# Altium project Oxy_Project.PrjPcb
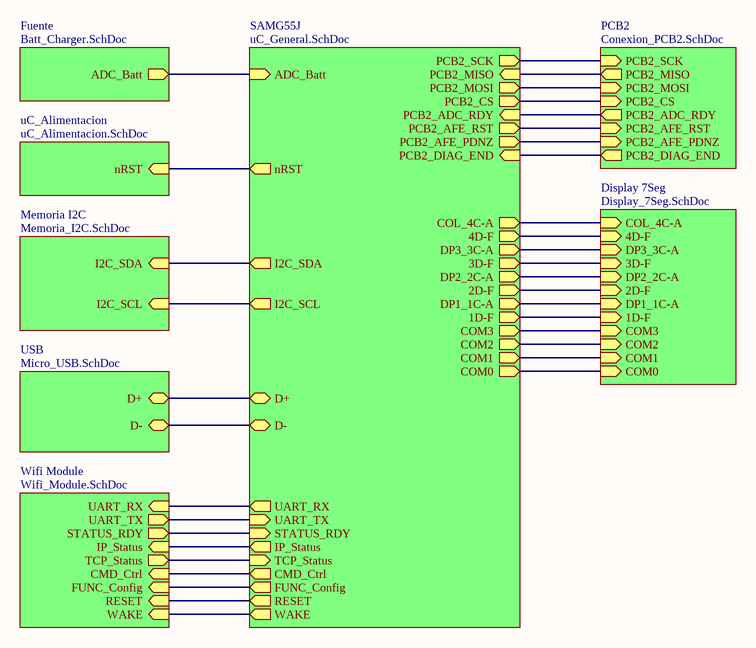
[diagram p0: TOP.SchDoc]
9 sheets, 84 parts. Net scope: hierarchical (ports join the sheet entries above them; power ports are global).
Board file: Oxy_PCB.PcbDoc
Sheets:
  TOP.SchDoc
    Memoria I2C = Memoria_I2C.SchDoc
    Fuente = Batt_Charger.SchDoc
    Wifi Module = Wifi_Module.SchDoc
    Display 7Seg = Display_7Seg.SchDoc
    USB = Micro_USB.SchDoc
    PCB2 = Conexion_PCB2.SchDoc
    uC_Alimentacion = uC_Alimentacion.SchDoc
    SAMG55J = uC_General.SchDoc

## Sheet TOP.SchDoc: Conexión General
size A4; Author: **; CompanyName: Introducción al Diseño de Circuitos Impresos; Organization: UTN FRBA; DocumentNumber: 1; Revision: 01; SheetNumber: 1; SheetTotal: 9; Autor: Eugenia Ipar

### Sub-sheets
Display 7Seg = Display_7Seg.SchDoc: COM0 (in), COM1 (in), COM2 (in), COM3 (in), 1D-F (in), DP1_1C-A (in), 2D-F (in), DP2_2C-A (in), 3D-F (in), DP3_3C-A (in), 4D-F (in), COL_4C-A (in)
Fuente = Batt_Charger.SchDoc: ADC_Batt (out)
Memoria I2C = Memoria_I2C.SchDoc: I2C_SDA (in), I2C_SCL (in)
PCB2 = Conexion_PCB2.SchDoc: PCB2_MOSI (in), PCB2_MISO (out), PCB2_AFE_RST (in), PCB2_DIAG_END (out), PCB2_CS (in), PCB2_AFE_PDNZ (in), PCB2_ADC_RDY (out), PCB2_SCK (in)
SAMG55J = uC_General.SchDoc: COM2 (out), DP3_3C-A (out), ADC_Batt (in), 3D-F (out), PCB2_ADC_RDY (in), PCB2_SCK (out), D+ (bidir), COM3 (out), DP2_2C-A (out), 4D-F (out), PCB2_AFE_PDNZ (out), PCB2_MISO (in), COM1 (out), 1D-F (out), DP1_1C-A (out), I2C_SCL (out), UART_RX (out), PCB2_AFE_RST (out), IP_Status (out), COL_4C-A (out), PCB2_DIAG_END (in), PCB2_MOSI (out), UART_TX (in), D- (bidir), I2C_SDA (out), COM0 (out), PCB2_CS (out), 2D-F (out), nRST (out), RESET (out), CMD_Ctrl (out), FUNC_Config (out), WAKE (out), STATUS_RDY (in), TCP_Status (in)
uC_Alimentacion = uC_Alimentacion.SchDoc: nRST (in)
USB = Micro_USB.SchDoc: D+ (bidir), D- (bidir)
Wifi Module = Wifi_Module.SchDoc: UART_RX (in), UART_TX (out), STATUS_RDY (out), IP_Status (in), TCP_Status (out), CMD_Ctrl (in), FUNC_Config (in), RESET (in), WAKE (in)

### Nets
1D-F: sheet Display 7Seg/1D-F, sheet SAMG55J/1D-F
2D-F: sheet Display 7Seg/2D-F, sheet SAMG55J/2D-F
3D-F: sheet Display 7Seg/3D-F, sheet SAMG55J/3D-F
4D-F: sheet Display 7Seg/4D-F, sheet SAMG55J/4D-F
ADC_Batt: sheet Fuente/ADC_Batt, sheet SAMG55J/ADC_Batt
COL_4C-A: sheet Display 7Seg/COL_4C-A, sheet SAMG55J/COL_4C-A
COM0: sheet Display 7Seg/COM0, sheet SAMG55J/COM0
COM1: sheet Display 7Seg/COM1, sheet SAMG55J/COM1
COM2: sheet Display 7Seg/COM2, sheet SAMG55J/COM2
COM3: sheet Display 7Seg/COM3, sheet SAMG55J/COM3
D+: sheet USB/D+, sheet SAMG55J/D+
D-: sheet USB/D-, sheet SAMG55J/D-
DP1_1C-A: sheet Display 7Seg/DP1_1C-A, sheet SAMG55J/DP1_1C-A
DP2_2C-A: sheet Display 7Seg/DP2_2C-A, sheet SAMG55J/DP2_2C-A
DP3_3C-A: sheet Display 7Seg/DP3_3C-A, sheet SAMG55J/DP3_3C-A
I2C_SCL: sheet Memoria I2C/I2C_SCL, sheet SAMG55J/I2C_SCL
I2C_SDA: sheet Memoria I2C/I2C_SDA, sheet SAMG55J/I2C_SDA
IP_Status: sheet Wifi Module/IP_Status, sheet SAMG55J/IP_Status
nRST: sheet uC_Alimentacion/nRST, sheet SAMG55J/nRST
PCB2_ADC_RDY: sheet PCB2/PCB2_ADC_RDY, sheet SAMG55J/PCB2_ADC_RDY
PCB2_AFE_PDNZ: sheet PCB2/PCB2_AFE_PDNZ, sheet SAMG55J/PCB2_AFE_PDNZ
PCB2_AFE_RST: sheet PCB2/PCB2_AFE_RST, sheet SAMG55J/PCB2_AFE_RST
PCB2_CS: sheet PCB2/PCB2_CS, sheet SAMG55J/PCB2_CS
PCB2_DIAG_END: sheet PCB2/PCB2_DIAG_END, sheet SAMG55J/PCB2_DIAG_END
PCB2_MISO: sheet PCB2/PCB2_MISO, sheet SAMG55J/PCB2_MISO
PCB2_MOSI: sheet PCB2/PCB2_MOSI, sheet SAMG55J/PCB2_MOSI
PCB2_SCK: sheet PCB2/PCB2_SCK, sheet SAMG55J/PCB2_SCK
STATUS_RDY: sheet Wifi Module/STATUS_RDY, sheet SAMG55J/STATUS_RDY
TCP_Status: sheet Wifi Module/TCP_Status, sheet SAMG55J/TCP_Status
UART_RX: sheet Wifi Module/UART_RX, sheet SAMG55J/UART_RX
UART_TX: sheet Wifi Module/UART_TX, sheet SAMG55J/UART_TX
NetR23_1: sheet Wifi Module/RESET, sheet SAMG55J/RESET
NetR24_1: sheet Wifi Module/WAKE, sheet SAMG55J/WAKE
NetU4_39: sheet Wifi Module/CMD_Ctrl, sheet SAMG55J/CMD_Ctrl
NetU4_56: sheet Wifi Module/FUNC_Config, sheet SAMG55J/FUNC_Config

### Notes on the sheet
- Title:
- Size:
- Author:
- A4
- Sheet
- of
- Revision:
- File:
- Date:

## Sheet Memoria_I2C.SchDoc: Memoria I2C
size A4; Autor: Eugenia Ipar; Author: **; CompanyName: Introducción al Diseño de Circuitos Impresos; Organization: UTN FRBA; DocumentNumber: 5; Revision: 01; SheetNumber: 5; SheetTotal: 9
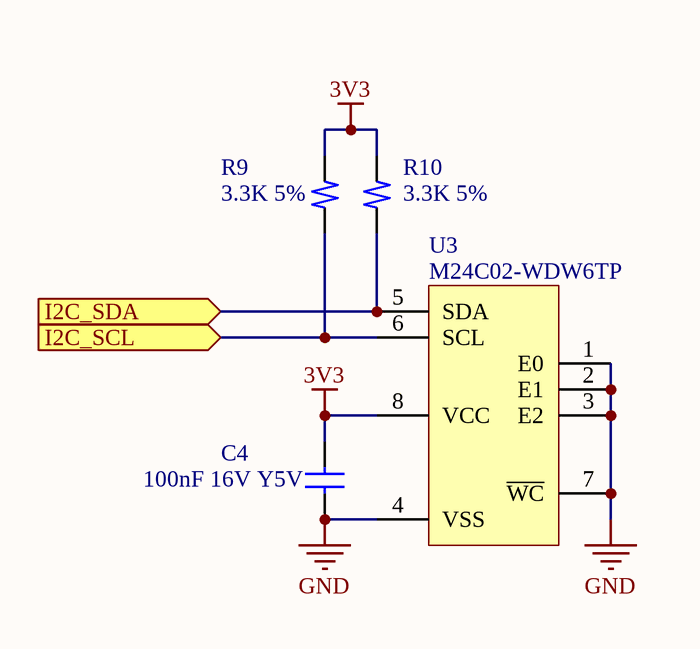
[diagram p1: Memoria_I2C.SchDoc]

### Parts
C4  100nF 16V Y5V  [C_0402]
R9  3.3K 5%  [R_0402]
R10  3.3K 5%  [R_0402]
U3  M24C02-WDW6TP  [TSSOP-8]

### Ports
I2C_SCL (in), I2C_SDA (in)

### Nets
3V3: C4.1 R9.2 R10.2 U3.8(VCC)
GND: C4.2 U3.1(E0) U3.2(E1) U3.3(E2) U3.4(VSS) U3.7(~{WC})
I2C_SCL: R9.1 U3.6(SCL) ; port I2C_SCL
I2C_SDA: R10.1 U3.5(SDA) ; port I2C_SDA

### Notes on the sheet
- Title:
- Size:
- Author:
- A4
- Sheet
- of
- Revision:
- File:
- Date:

### Library data of the parts
C4 = Ceramic Capacitor: Ceramic Capacitor SMD 0402
R9 R10 = Resistor: Resistor SMD 0402
U3 = EEPROM M24C02-WDW6TP: M24C02-WDW6TP 2.5-5V 2Kbit Serial I2C Bus EEPROM

## Sheet Batt_Charger.SchDoc: Cargador de Batería y Regulador
size A4; CompanyName: Introducción al Diseño de Circuitos Impresos; Organization: UTN FRBA; DocumentNumber: 4; Revision: 01; SheetNumber: 4; SheetTotal: 9; Autor: Eugenia Ipar
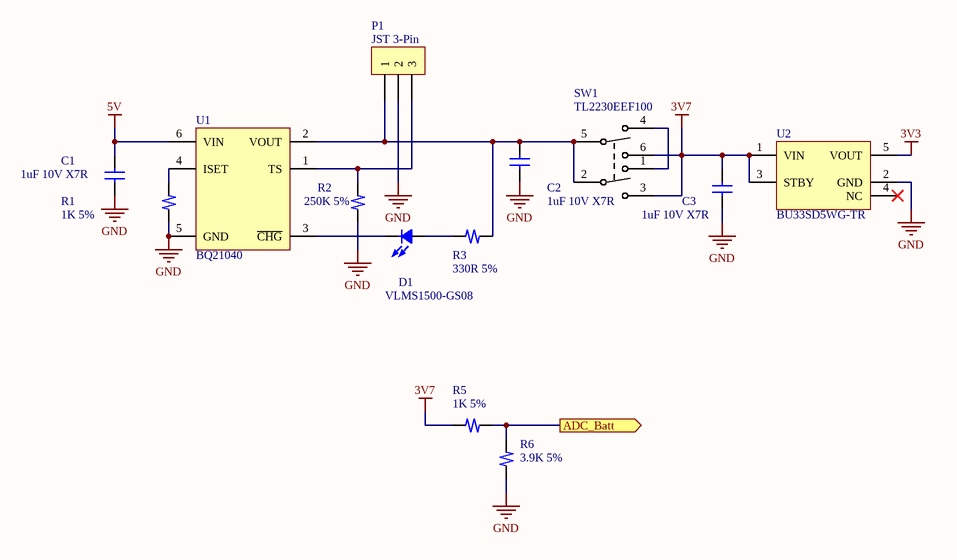
[diagram p2: Batt_Charger.SchDoc]

### Parts
C1  1uF 10V X7R  [C_0402]
C2  1uF 10V X7R  [C_0402]
C3  1uF 10V X7R  [C_0402]
D1  VLMS1500-GS08  [L_0402]
P1  JST 3-Pin  [BATT CONNECTOR]
R1  1K 5%  [R_0402]
R2  250K 5%  [R_0402]
R3  330R 5%  [R_0402]
R5  1K 5%  [R_0402]
R6  3.9K 5%  [R_0402]
SW1  TL2230EEF100  [TL2230]
U1  BQ21040  [SOT-23 (6)]
U2  BU33SD5WG-TR  [SSOP5]

### Ports
ADC_Batt (out)

### Nets
3V3: U2.5(VOUT)
3V7: C3.1 R5.1 SW1.3 SW1.6 U2.1(VIN) U2.3(STBY)
5V: C1.1 U1.6(VIN)
GND: C1.2 C2.2 C3.2 P1.2 R1.1 R2.1 R6.1 U1.5(GND) U2.2(GND)
ADC_Batt: R5.2 R6.2 ; port ADC_Batt
NetC2_1: C2.1 P1.1 R3.1 SW1.2 SW1.5 U1.2(VOUT)
NetD1_1: D1.1 R3.2
NetD1_2: D1.2 U1.3(~{CHG})
NetP1_3: P1.3 R2.2 U1.1(TS)
NetR1_2: R1.2 U1.4(ISET)
NetSW1_1: SW1.1 SW1.4

Not connected (* = marked no-connect by the designer): U2 4(NC)*

### Notes on the sheet
- Title:
- Size:
- Author:
- A4
- Sheet
- of
- Revision:
- File:
- Date:

### Library data of the parts
C1-C3 = Ceramic Capacitor: Ceramic Capacitor SMD 0402
D1 = Diode LED: LED Diode SMD 0402
P1 = 3-Pin Header: JST Right Angle Connector THD 3-Pin PN: PRT-09750
R1-R3 R5 R6 = Resistor: Resistor SMD 0402
SW1 = PushButton Switch: PushButton Switch Latching THD TL2230EEF100
U1 = BQ21040 Charger: BQ21040 0.8A Sigle Cell Li-Ion Battery Charger SOT-23
U2 = LDO CMOS Regulator: LDO Voltage Regulator 1ch 500mA CMOS SSOP5

## Sheet Wifi_Module.SchDoc: Módulo Wifi RN1810
size A4; Author: **; CompanyName: Introducción al Diseño de Circuitos Impresos; Organization: UTN FRBA; DocumentNumber: 6; Revision: 01; SheetNumber: 6; SheetTotal: 9; Autor: Eugenia Ipar
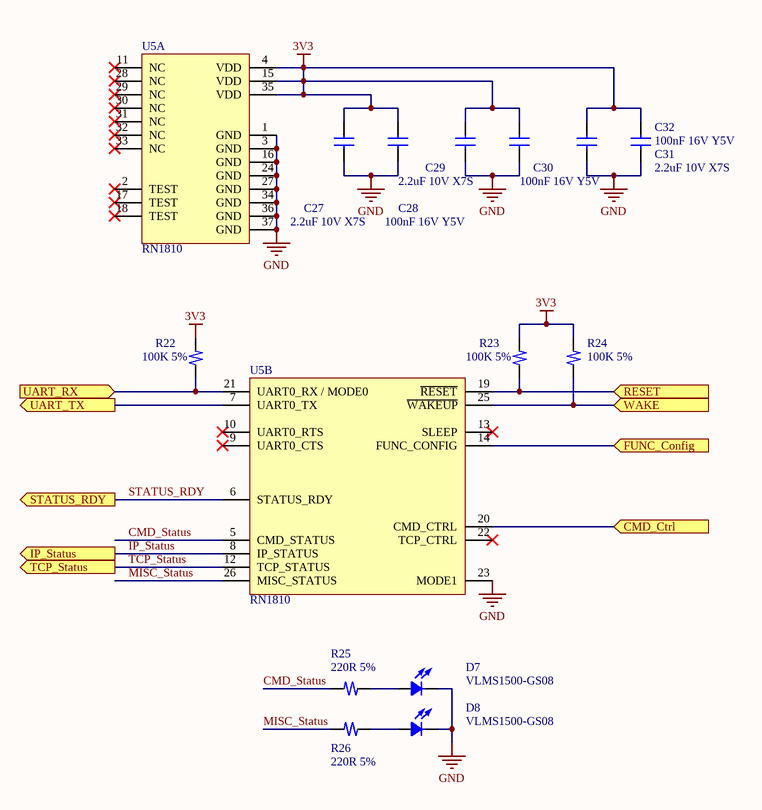
[diagram p3: Wifi_Module.SchDoc]

### Parts
C27  2.2uF 10V X7S  [C_0402]
C28  100nF 16V Y5V  [C_0402]
C29  2.2uF 10V X7S  [C_0402]
C30  100nF 16V Y5V  [C_0402]
C31  2.2uF 10V X7S  [C_0402]
C32  100nF 16V Y5V  [C_0402]
D7  VLMS1500-GS08  [L_0402]
D8  VLMS1500-GS08  [L_0402]
R22  100K 5%  [R_0402]
R23  100K 5%  [R_0402]
R24  100K 5%  [R_0402]
R25  220R 5%  [R_0402]
R26  220R 5%  [R_0402]
U5  RN1810  [RN1810]  (parts A,B of 2)

### Ports
CMD_Ctrl (in), FUNC_Config (in), IP_Status (out), RESET (in), STATUS_RDY (out), TCP_Status (out), UART_RX (in), UART_TX (out), WAKE (in)

### Nets
3V3: C27.1 C28.1 C29.1 C30.1 C31.1 C32.1 R22.2 R23.2 R24.2 U5.4(VDD) U5.15(VDD) U5.35(VDD)
GND: C27.2 C28.2 C29.2 C30.2 C31.2 C32.2 D7.2 D8.2 U5.1(GND) U5.3(GND) U5.16(GND) U5.23(MODE1) U5.24(GND) U5.27(GND) U5.34(GND) U5.36(GND) U5.37(GND)
CMD_Status: R25.1 U5.5(CMD_STATUS)
IP_Status: U5.8(IP_STATUS) ; port IP_Status
MISC_Status: R26.1 U5.26(MISC_STATUS)
STATUS_RDY: U5.6(STATUS_RDY) ; port STATUS_RDY
TCP_Status: U5.12(TCP_STATUS) ; port TCP_Status
UART_RX: R22.1 U5.21(UART0_RX_/_MODE0) ; port UART_RX
UART_TX: U5.7(UART0_TX) ; port UART_TX
NetD7_1: D7.1 R25.2
NetD8_1: D8.1 R26.2
NetR23_1: R23.1 U5.19(~{RESET}) ; port RESET
NetR24_1: R24.1 U5.25(~{WAKEUP}) ; port WAKE
NetU4_39: U5.20(CMD_CTRL) ; port CMD_Ctrl
NetU4_56: U5.14(FUNC_CONFIG) ; port FUNC_Config

Not connected (* = marked no-connect by the designer): U5 2(TEST)* 9(UART0_CTS)* 10(UART0_RTS)* 11(NC)* 13(SLEEP)* 17(TEST)* 18(TEST)* 22(TCP_CTRL)* 28(NC)* 29(NC)* 30(NC)* 31(NC)* 32(NC)* 33(NC)*

### Notes on the sheet
- Title:
- Size:
- Author:
- A4
- Sheet
- of
- Revision:
- File:
- Date:

### Library data of the parts
C27-C32 = Ceramic Capacitor: Ceramic Capacitor SMD 0402
D7 D8 = Diode LED: LED Diode SMD 0402
R22-R26 = Resistor: Resistor SMD 0402
U5 = RN1810 Wifi Module: 2.4 GHz IEEE 802.11b/g/n Wireless Module RN1810

## Sheet Display_7Seg.SchDoc: Display LCD de 7 Segmentos
size A4; Author: **; CompanyName: Introducción al Diseño de Circuitos Impresos; Organization: UTN FRBA; DocumentNumber: 7; Revision: 01; SheetNumber: 7; SheetTotal: 9; Autor: Eugenia Ipar
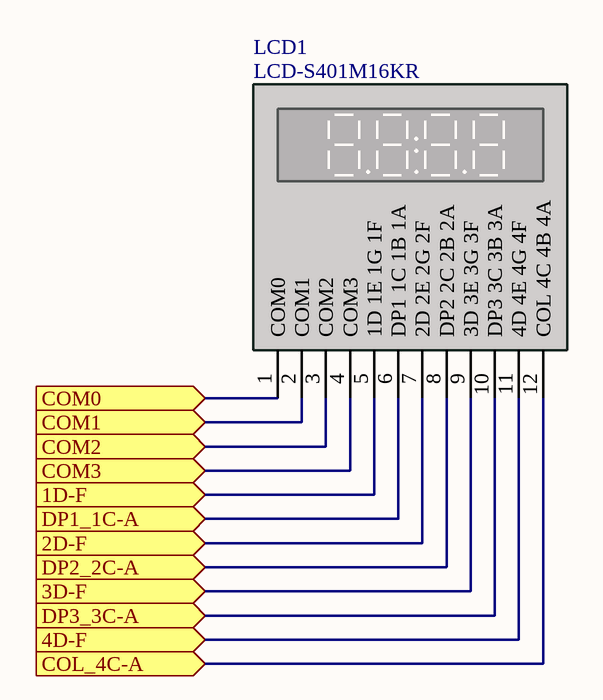
[diagram p4: Display_7Seg.SchDoc]

### Parts
LCD1  LCD-S401M16KR  [7 SEG]

### Ports
1D-F (in), 2D-F (in), 3D-F (in), 4D-F (in), COL_4C-A (in), COM0 (in), COM1 (in), COM2 (in), COM3 (in), DP1_1C-A (in), DP2_2C-A (in), DP3_3C-A (in)

### Nets
1D-F: LCD1.5(1D_1E_1G_1F) ; port 1D-F
2D-F: LCD1.7(2D_2E_2G_2F) ; port 2D-F
3D-F: LCD1.9(3D_3E_3G_3F) ; port 3D-F
4D-F: LCD1.11(4D_4E_4G_4F) ; port 4D-F
COL_4C-A: LCD1.12(COL_4C_4B_4A) ; port COL_4C-A
COM0: LCD1.1(COM0) ; port COM0
COM1: LCD1.2(COM1) ; port COM1
COM2: LCD1.3(COM2) ; port COM2
COM3: LCD1.4(COM3) ; port COM3
DP1_1C-A: LCD1.6(DP1_1C_1B_1A) ; port DP1_1C-A
DP2_2C-A: LCD1.8(DP2_2C_2B_2A) ; port DP2_2C-A
DP3_3C-A: LCD1.10(DP3_3C_3B_3A) ; port DP3_3C-A

### Notes on the sheet
- Title:
- Size:
- Author:
- A4
- Sheet
- of
- Revision:
- File:
- Date:

### Library data of the parts
LCD1 = LCD Display 7-Seg: Lumex LCD Numeric Display 7-Seg 4 Digit S401M16KR

## Sheet Micro_USB.SchDoc: Conexión Micro-USB
size A4; Author: **; CompanyName: Introducción al Diseño de Circuitos Impresos; Organization: UTN FRBA; DocumentNumber: 8; Revision: 01; SheetNumber: 8; SheetTotal: 9; Autor: Eugenia Ipar
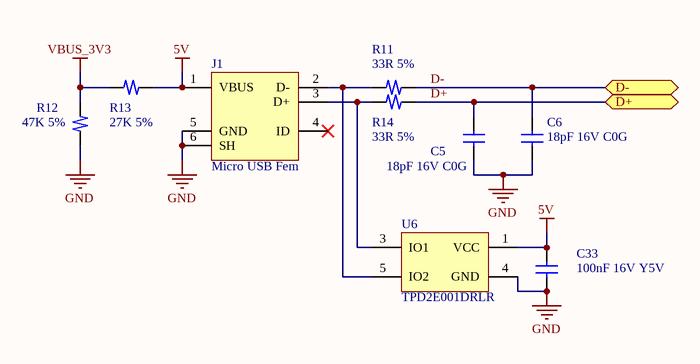
[diagram p5: Micro_USB.SchDoc]

### Parts
C5  18pF 16V C0G  [C_0402]
C6  18pF 16V C0G  [C_0402]
C33  100nF 16V Y5V  [C_0402]
J1  Micro USB Fem  [Micro USB]
R11  33R 5%  [R_0402]
R12  47K 5%  [R_0402]
R13  27K 5%  [R_0402]
R14  33R 5%  [R_0402]
U6  TPD2E001DRLR  [TPD2E001]

### Ports
D+ (bidir), D- (bidir)

### Nets
5V: C33.1 J1.1(VBUS) R13.2 U6.1(VCC)
GND: C5.2 C6.2 C33.2 J1.5(GND) J1.6(SH) R12.1 U6.4(GND)
VBUS_3V3: R12.2 R13.1
D+: C5.1 R14.2 ; port D+
D-: C6.1 R11.2 ; port D-
NetJ1_2: J1.2(D-) R11.1 U6.5(IO2)
NetJ1_3: J1.3(D+) R14.1 U6.3(IO1)

Not connected (* = marked no-connect by the designer): J1 4(ID)*

### Notes on the sheet
- Title:
- Size:
- Author:
- A4
- Sheet
- of
- Revision:
- File:
- Date:

### Library data of the parts
C5 C6 C33 = Ceramic Capacitor: Ceramic Capacitor SMD 0402
J1 = Micro USB Connector: Micro-USB 2.0 AB Receptacle, Right Angle, Part Number 47590-0001
R11-R14 = Resistor: Resistor SMD 0402
U6 = Diode ESD-Protection: Low-Capacitance 2-Ch ESD-Protection for High-Speed Data Interfaces, SOT5

## Sheet Conexion_PCB2.SchDoc: Conexión a Placa de Medición
size A4; Author: **; CompanyName: Introducción al Diseño de Circuitos Impresos; Organization: UTN FRBA; DocumentNumber: 9; Revision: 01; SheetNumber: 9; SheetTotal: 9; Autor: Eugenia Ipar
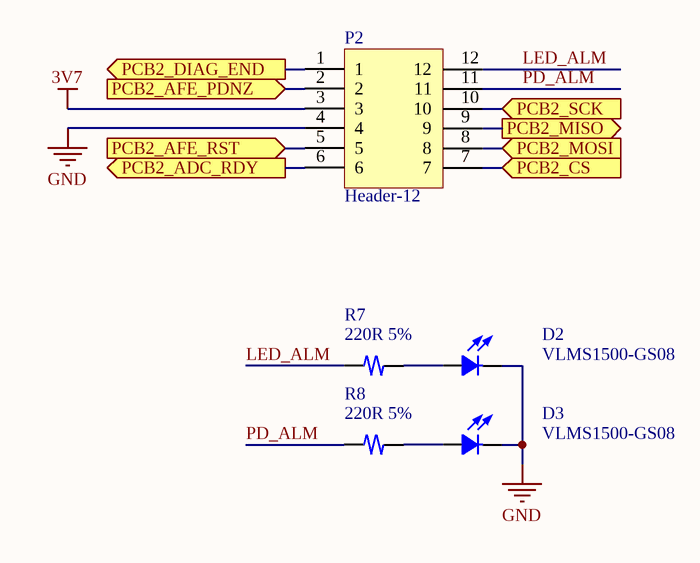
[diagram p6: Conexion_PCB2.SchDoc]

### Parts
D2  VLMS1500-GS08  [L_0402]
D3  VLMS1500-GS08  [L_0402]
P2  Header-12  [HEADER 12]
R7  220R 5%  [R_0402]
R8  220R 5%  [R_0402]

### Ports
PCB2_ADC_RDY (out), PCB2_AFE_PDNZ (in), PCB2_AFE_RST (in), PCB2_CS (in), PCB2_DIAG_END (out), PCB2_MISO (out), PCB2_MOSI (in), PCB2_SCK (in)

### Nets
3V7: P2.3
GND: D2.2 D3.2 P2.4
LED_ALM: P2.12 R7.1
PCB2_ADC_RDY: P2.6 ; port PCB2_ADC_RDY
PCB2_AFE_PDNZ: P2.2 ; port PCB2_AFE_PDNZ
PCB2_AFE_RST: P2.5 ; port PCB2_AFE_RST
PCB2_CS: P2.7 ; port PCB2_CS
PCB2_DIAG_END: P2.1 ; port PCB2_DIAG_END
PCB2_MISO: P2.9 ; port PCB2_MISO
PCB2_MOSI: P2.8 ; port PCB2_MOSI
PCB2_SCK: P2.10 ; port PCB2_SCK
PD_ALM: P2.11 R8.1
NetD2_1: D2.1 R7.2
NetD3_1: D3.1 R8.2

### Notes on the sheet
- Title:
- Size:
- Author:
- A4
- Sheet
- of
- Revision:
- File:
- Date:

### Library data of the parts
D2 D3 = Diode LED: LED Diode SMD 0402
P2 = 12-Pin Header: Board to Board & Mezzanine Connector 0.8 BtB Molex PN: 53307-1271
R7 R8 = Resistor: Resistor SMD 0402

## Sheet uC_Alimentacion.SchDoc: Microcontrolador - Alimentación
size A4; Author: **; CompanyName: Introducción al Diseño de Circuitos Impresos; Organization: UTN FRBA; DocumentNumber: 3; Revision: 01; SheetNumber: 3; SheetTotal: 9; Autor: Eugenia Ipar
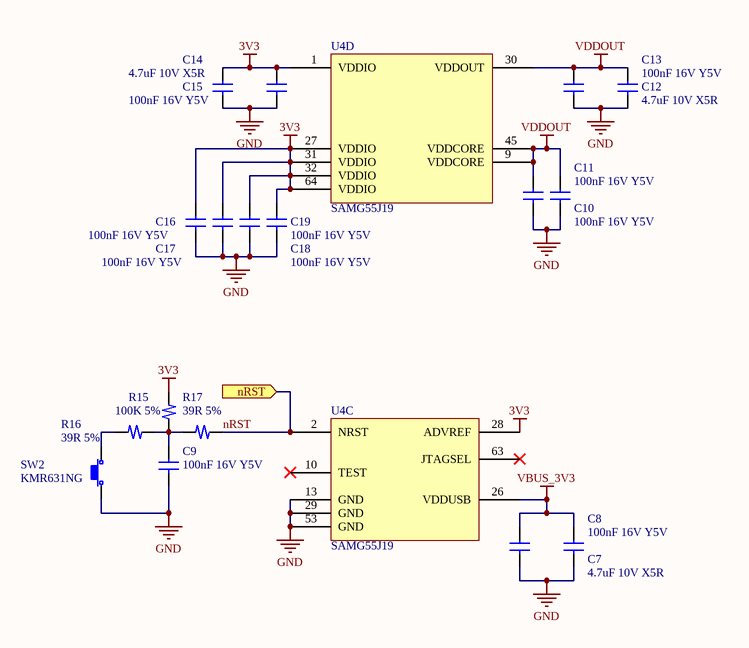
[diagram p7: uC_Alimentacion.SchDoc]

### Parts
C7  4.7uF 10V X5R  [C_0402]
C8  100nF 16V Y5V  [C_0402]
C9  100nF 16V Y5V  [C_0402]
C10  100nF 16V Y5V  [C_0402]
C11  100nF 16V Y5V  [C_0402]
C12  4.7uF 10V X5R  [C_0402]
C13  100nF 16V Y5V  [C_0402]
C14  4.7uF 10V X5R  [C_0402]
C15  100nF 16V Y5V  [C_0402]
C16  100nF 16V Y5V  [C_0402]
C17  100nF 16V Y5V  [C_0402]
C18  100nF 16V Y5V  [C_0402]
C19  100nF 16V Y5V  [C_0402]
R15  100K 5%  [R_0402]
R16  39R 5%  [R_0402]
R17  39R 5%  [R_0402]
SW2  KMR631NG  [TACT SWITCH]
U4  SAMG55J19  [LQFP 64]  (parts C,D of 4)

### Ports
nRST (in)

### Nets
3V3: C14.1 C15.1 C16.1 C17.1 C18.1 C19.1 R15.2 U4.1(VDDIO) U4.27(VDDIO) U4.28(ADVREF) U4.31(VDDIO) U4.32(VDDIO) U4.64(VDDIO)
GND: C7.2 C8.2 C9.2 C10.2 C11.2 C12.2 C13.2 C14.2 C15.2 C16.2 C17.2 C18.2 C19.2 SW2.1 U4.13(GND) U4.29(GND) U4.53(GND)
VBUS_3V3: C7.1 C8.1 U4.26(VDDUSB)
VDDOUT: C10.1 C11.1 C12.1 C13.1 U4.9(VDDCORE) U4.30(VDDOUT) U4.45(VDDCORE)
nRST: R17.2 U4.2(NRST) ; port nRST
NetC9_1: C9.1 R15.1 R16.2 R17.1
NetR16_1: R16.1 SW2.2

Not connected (* = marked no-connect by the designer): U4 10(TEST)* 63(JTAGSEL)*

### Notes on the sheet
- Title:
- Size:
- Author:
- A4
- Sheet
- of
- Revision:
- File:
- Date:

### Library data of the parts
C7-C19 = Ceramic Capacitor: Ceramic Capacitor SMD 0402
R15-R17 = Resistor: Resistor SMD 0402
SW2 = Tact Switch
U4 = SAMG55J19: Atmel SMART SAM G55 Cortex M4 32-bit 64-lead LQFP

## Sheet uC_General.SchDoc: Microcontrolador SAMG55
size A4; Author: **; CompanyName: Introducción al Diseño de Circuitos Impresos; Organization: UTN FRBA; DocumentNumber: 2; Revision: 01; SheetNumber: 2; SheetTotal: 9; Autor: Eugenia Ipar
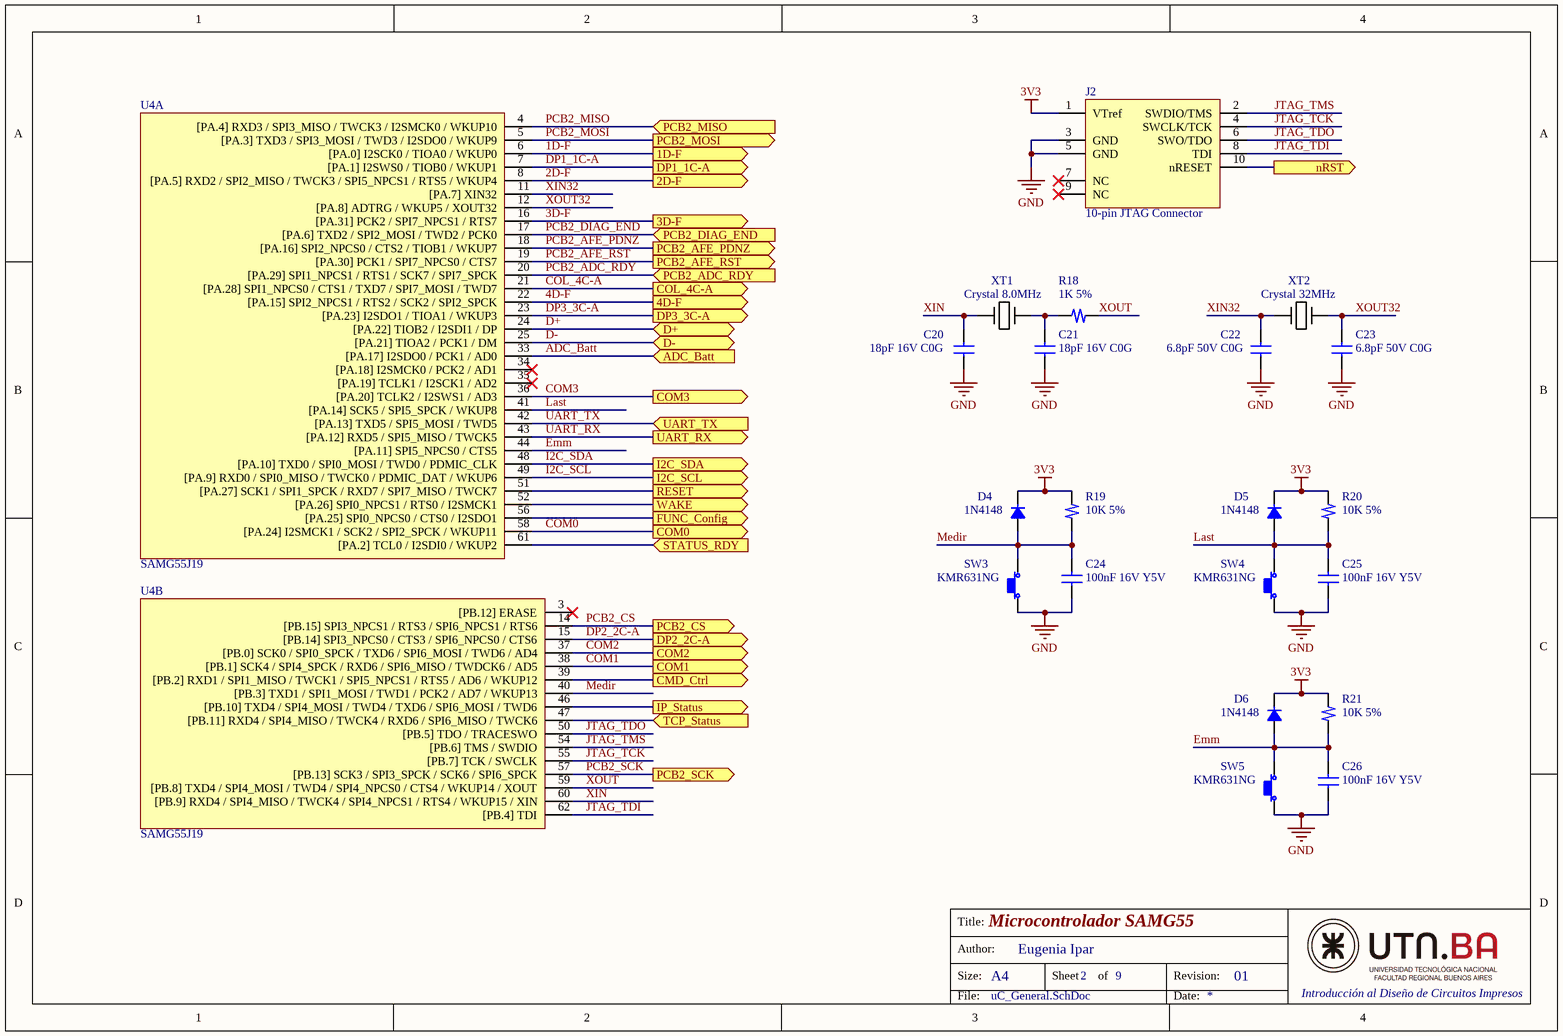
[diagram p8: uC_General.SchDoc]

### Parts
C20  18pF 16V C0G  [C_0402]
C21  18pF 16V C0G  [C_0402]
C22  6.8pF 50V C0G  [C_0402]
C23  6.8pF 50V C0G  [C_0402]
C24  100nF 16V Y5V  [C_0402]
C25  100nF 16V Y5V  [C_0402]
C26  100nF 16V Y5V  [C_0402]
D4  1N4148  [SOD523]
D5  1N4148  [SOD523]
D6  1N4148  [SOD523]
J2  10-pin JTAG Connector  [JTAG HEADER]
R18  1K 5%  [R_0402]
R19  10K 5%  [R_0402]
R20  10K 5%  [R_0402]
R21  10K 5%  [R_0402]
SW3  KMR631NG  [TACT SWITCH]
SW4  KMR631NG  [TACT SWITCH]
SW5  KMR631NG  [TACT SWITCH]
U4  SAMG55J19  [LQFP 64]  (parts A,B of 4)
XT1  Crystal 8.0MHz  [CRYSTAL_8]
XT2  Crystal 32MHz  [FC-135]

### Ports
1D-F (out), 2D-F (out), 3D-F (out), 4D-F (out), ADC_Batt (in), CMD_Ctrl (out), COL_4C-A (out), COM0 (out), COM1 (out), COM2 (out), COM3 (out), D+ (bidir), D- (bidir), DP1_1C-A (out), DP2_2C-A (out), DP3_3C-A (out), FUNC_Config (out), I2C_SCL (out), I2C_SDA (out), IP_Status (out), nRST (out), PCB2_ADC_RDY (in), PCB2_AFE_PDNZ (out), PCB2_AFE_RST (out), PCB2_CS (out), PCB2_DIAG_END (in), PCB2_MISO (in), PCB2_MOSI (out), PCB2_SCK (out), RESET (out), STATUS_RDY (in), TCP_Status (in), UART_RX (out), UART_TX (in), WAKE (out)

### Nets
3V3: D4.2 D5.2 D6.2 J2.1(VTref) R19.2 R20.2 R21.2
GND: C20.2 C21.2 C22.2 C23.2 C24.2 C25.2 C26.2 J2.3(GND) J2.5(GND) SW3.1 SW4.1 SW5.1
1D-F: U4.6([PA.0]_I2SCK0_/_TIOA0_/_WKUP0) ; port 1D-F
2D-F: U4.8([PA.5]_RXD2_/_SPI2_MISO_/_TWCK3_/_SPI5_NPCS1_/_RTS5_/_WKUP4) ; port 2D-F
3D-F: U4.16([PA.31]_PCK2_/_SPI7_NPCS1_/_RTS7) ; port 3D-F
4D-F: U4.22([PA.15]_SPI2_NPCS1_/_RTS2_/_SCK2_/_SPI2_SPCK) ; port 4D-F
ADC_Batt: U4.33([PA.17]_I2SDO0_/_PCK1_/_AD0) ; port ADC_Batt
COL_4C-A: U4.21([PA.28]_SPI1_NPCS0_/_CTS1_/_TXD7_/_SPI7_MOSI_/_TWD7) ; port COL_4C-A
COM0: U4.58([PA.24]_I2SMCK1_/_SCK2_/_SPI2_SPCK_/_WKUP11) ; port COM0
COM1: U4.38([PB.1]_SCK4_/_SPI4_SPCK_/_RXD6_/_SPI6_MISO_/_TWDCK6_/_AD5) ; port COM1
COM2: U4.37([PB.0]_SCK0_/_SPI0_SPCK_/_TXD6_/_SPI6_MOSI_/_TWD6_/_AD4) ; port COM2
COM3: U4.36([PA.20]_TCLK2_/_I2SWS1_/_AD3) ; port COM3
D+: U4.24([PA.22]_TIOB2_/_I2SDI1_/_DP) ; port D+
D-: U4.25([PA.21]_TIOA2_/_PCK1_/_DM) ; port D-
DP1_1C-A: U4.7([PA.1]_I2SWS0_/_TIOB0_/_WKUP1) ; port DP1_1C-A
DP2_2C-A: U4.15([PB.14]_SPI3_NPCS0_/_CTS3_/_SPI6_NPCS0_/_CTS6) ; port DP2_2C-A
DP3_3C-A: U4.23([PA.23]_I2SDO1_/_TIOA1_/_WKUP3) ; port DP3_3C-A
Emm: C26.1 D6.1 R21.1 SW5.2 U4.44([PA.11]_SPI5_NPCS0_/_CTS5)
I2C_SCL: U4.49([PA.9]_RXD0_/_SPI0_MISO_/_TWCK0_/_PDMIC_DAT_/_WKUP6) ; port I2C_SCL
I2C_SDA: U4.48([PA.10]_TXD0_/_SPI0_MOSI_/_TWD0_/_PDMIC_CLK) ; port I2C_SDA
IP_Status: U4.46([PB.10]_TXD4_/_SPI4_MOSI_/_TWD4_/_TXD6_/_SPI6_MOSI_/_TWD6) ; port IP_Status
JTAG_TCK: J2.4(SWCLK/TCK) U4.55([PB.7]_TCK_/_SWCLK)
JTAG_TDI: J2.8(TDI) U4.62([PB.4]_TDI)
JTAG_TDO: J2.6(SWO/TDO) U4.50([PB.5]_TDO_/_TRACESWO)
JTAG_TMS: J2.2(SWDIO/TMS) U4.54([PB.6]_TMS_/_SWDIO)
Last: C25.1 D5.1 R20.1 SW4.2 U4.41([PA.14]_SCK5_/_SPI5_SPCK_/_WKUP8)
Medir: C24.1 D4.1 R19.1 SW3.2 U4.40([PB.3]_TXD1_/_SPI1_MOSI_/_TWD1_/_PCK2_/_AD7_/_WKUP13)
nRST: J2.10(nRESET) ; port nRST
PCB2_ADC_RDY: U4.20([PA.29]_SPI1_NPCS1_/_RTS1_/_SCK7_/_SPI7_SPCK) ; port PCB2_ADC_RDY
PCB2_AFE_PDNZ: U4.18([PA.16]_SPI2_NPCS0_/_CTS2_/_TIOB1_/_WKUP7) ; port PCB2_AFE_PDNZ
PCB2_AFE_RST: U4.19([PA.30]_PCK1_/_SPI7_NPCS0_/_CTS7) ; port PCB2_AFE_RST
PCB2_CS: U4.14([PB.15]_SPI3_NPCS1_/_RTS3_/_SPI6_NPCS1_/_RTS6) ; port PCB2_CS
PCB2_DIAG_END: U4.17([PA.6]_TXD2_/_SPI2_MOSI_/_TWD2_/_PCK0) ; port PCB2_DIAG_END
PCB2_MISO: U4.4([PA.4]_RXD3_/_SPI3_MISO_/_TWCK3_/_I2SMCK0_/_WKUP10) ; port PCB2_MISO
PCB2_MOSI: U4.5([PA.3]_TXD3_/_SPI3_MOSI_/_TWD3_/_I2SDO0_/_WKUP9) ; port PCB2_MOSI
PCB2_SCK: U4.57([PB.13]_SCK3_/_SPI3_SPCK_/_SCK6_/_SPI6_SPCK) ; port PCB2_SCK
STATUS_RDY: U4.61([PA.2]_TCL0_/_I2SDI0_/_WKUP2) ; port STATUS_RDY
TCP_Status: U4.47([PB.11]_RXD4_/_SPI4_MISO_/_TWCK4_/_RXD6_/_SPI6_MISO_/_TWCK6) ; port TCP_Status
UART_RX: U4.43([PA.12]_RXD5_/_SPI5_MISO_/_TWCK5) ; port UART_RX
UART_TX: U4.42([PA.13]_TXD5_/_SPI5_MOSI_/_TWD5) ; port UART_TX
XIN: C20.1 U4.60([PB.9]_RXD4_/_SPI4_MISO_/_TWCK4_/_SPI4_NPCS1_/_RTS4_/_WKUP15_/_XIN) XT1.1(IN)
XIN32: C22.1 U4.11([PA.7]_XIN32) XT2.1(IN)
XOUT: R18.2 U4.59([PB.8]_TXD4_/_SPI4_MOSI_/_TWD4_/_SPI4_NPCS0_/_CTS4_/_WKUP14_/_XOUT)
XOUT32: C23.1 U4.12([PA.8]_ADTRG_/_WKUP5_/_XOUT32) XT2.2(OUT)
NetC21_1: C21.1 R18.1 XT1.2(OUT)
NetR23_1: U4.51([PA.27]_SCK1_/_SPI1_SPCK_/_RXD7_/_SPI7_MISO_/_TWCK7) ; port RESET
NetR24_1: U4.52([PA.26]_SPI0_NPCS1_/_RTS0_/_I2SMCK1) ; port WAKE
NetU4_39: U4.39([PB.2]_RXD1_/_SPI1_MISO_/_TWCK1_/_SPI5_NPCS1_/_RTS5_/_AD6_/_WKUP12) ; port CMD_Ctrl
NetU4_56: U4.56([PA.25]_SPI0_NPCS0_/_CTS0_/_I2SDO1) ; port FUNC_Config

Not connected (* = marked no-connect by the designer): J2 7(NC)* 9(NC)*; U4 3([PB.12]_ERASE)* 34([PA.18]_I2SMCK0_/_PCK2_/_AD1)* 35([PA.19]_TCLK1_/_I2SCK1_/_AD2)*

### Notes on the sheet
- Title:
- Size:
- Author:
- A4
- Sheet
- of
- Revision:
- File:
- Date:

### Library data of the parts
C20-C26 = Ceramic Capacitor: Ceramic Capacitor SMD 0402
D4-D6 = Diode 1N4148: Diode 1N4148 SMD SOD523
J2 = JTAG Connector: JTAG Connector Micro Terminal Strip .050" 10pin 2row
R18-R21 = Resistor: Resistor SMD 0402
SW3-SW5 = Tact Switch
U4 = SAMG55J19: as U4 on sheet uC_Alimentacion
XT1 = Crystal 8MHz: Crystal Oscillator 8.0MHz 20ppm 18pF PN: ABM7-8.000MHZ-D2Y-T
XT2 = Crystal 32MHz: Crystal Oscillator 32.768KHz 20ppm 7.0 pF PN: FC-135 32.7680KA-AG0

## Nets that join several sheets
3V3: Memoria_I2C (C4.1 R9.2 R10.2 U3.8), Batt_Charger (U2.5), Wifi_Module (12 pins), uC_Alimentacion (13 pins), uC_General (7 pins)
3V7: Batt_Charger (6 pins), Conexion_PCB2 (P2.3)
5V: Batt_Charger (C1.1 U1.6), Micro_USB (C33.1 J1.1 R13.2 U6.1)
GND: Memoria_I2C (6 pins), Batt_Charger (9 pins), Wifi_Module (17 pins), Micro_USB (7 pins), Conexion_PCB2 (D2.2 D3.2 P2.4), uC_Alimentacion (17 pins), uC_General (12 pins)
VBUS_3V3: Micro_USB (R12.2 R13.1), uC_Alimentacion (C7.1 C8.1 U4.26)
1D-F: Display_7Seg (LCD1.5), uC_General (U4.6)
2D-F: Display_7Seg (LCD1.7), uC_General (U4.8)
3D-F: Display_7Seg (LCD1.9), uC_General (U4.16)
4D-F: Display_7Seg (LCD1.11), uC_General (U4.22)
ADC_Batt: Batt_Charger (R5.2 R6.2), uC_General (U4.33)
COL_4C-A: Display_7Seg (LCD1.12), uC_General (U4.21)
COM0: Display_7Seg (LCD1.1), uC_General (U4.58)
COM1: Display_7Seg (LCD1.2), uC_General (U4.38)
COM2: Display_7Seg (LCD1.3), uC_General (U4.37)
COM3: Display_7Seg (LCD1.4), uC_General (U4.36)
D+: Micro_USB (C5.1 R14.2), uC_General (U4.24)
D-: Micro_USB (C6.1 R11.2), uC_General (U4.25)
DP1_1C-A: Display_7Seg (LCD1.6), uC_General (U4.7)
DP2_2C-A: Display_7Seg (LCD1.8), uC_General (U4.15)
DP3_3C-A: Display_7Seg (LCD1.10), uC_General (U4.23)
I2C_SCL: Memoria_I2C (R9.1 U3.6), uC_General (U4.49)
I2C_SDA: Memoria_I2C (R10.1 U3.5), uC_General (U4.48)
IP_Status: Wifi_Module (U5.8), uC_General (U4.46)
NetR23_1: Wifi_Module (R23.1 U5.19), uC_General (U4.51)
NetR24_1: Wifi_Module (R24.1 U5.25), uC_General (U4.52)
NetU4_39: Wifi_Module (U5.20), uC_General (U4.39)
NetU4_56: Wifi_Module (U5.14), uC_General (U4.56)
nRST: uC_Alimentacion (R17.2 U4.2), uC_General (J2.10)
PCB2_ADC_RDY: Conexion_PCB2 (P2.6), uC_General (U4.20)
PCB2_AFE_PDNZ: Conexion_PCB2 (P2.2), uC_General (U4.18)
PCB2_AFE_RST: Conexion_PCB2 (P2.5), uC_General (U4.19)
PCB2_CS: Conexion_PCB2 (P2.7), uC_General (U4.14)
PCB2_DIAG_END: Conexion_PCB2 (P2.1), uC_General (U4.17)
PCB2_MISO: Conexion_PCB2 (P2.9), uC_General (U4.4)
PCB2_MOSI: Conexion_PCB2 (P2.8), uC_General (U4.5)
PCB2_SCK: Conexion_PCB2 (P2.10), uC_General (U4.57)
STATUS_RDY: Wifi_Module (U5.6), uC_General (U4.61)
TCP_Status: Wifi_Module (U5.12), uC_General (U4.47)
UART_RX: Wifi_Module (R22.1 U5.21), uC_General (U4.43)
UART_TX: Wifi_Module (U5.7), uC_General (U4.42)